# Altium schematic sheet Mini51BSch.SchDoc
size 284 x 210 mm; PageSetup: Record=PageOptions|CenterHorizontal=True|CenterVertical=True|PrintScale=0.98|XCorrection=1.00|YCorrection=1.00|PrintKind=0|BorderSize=5000000|LeftOffset=0|BottomOffset=0|Orientation=2|PaperLength=1000|PaperWidth=1000|Scale=100|PaperSource=7|PrintQuality=-4|MediaType=1|DitherType=10|PaperKind=A4|PrintScaleMode=1
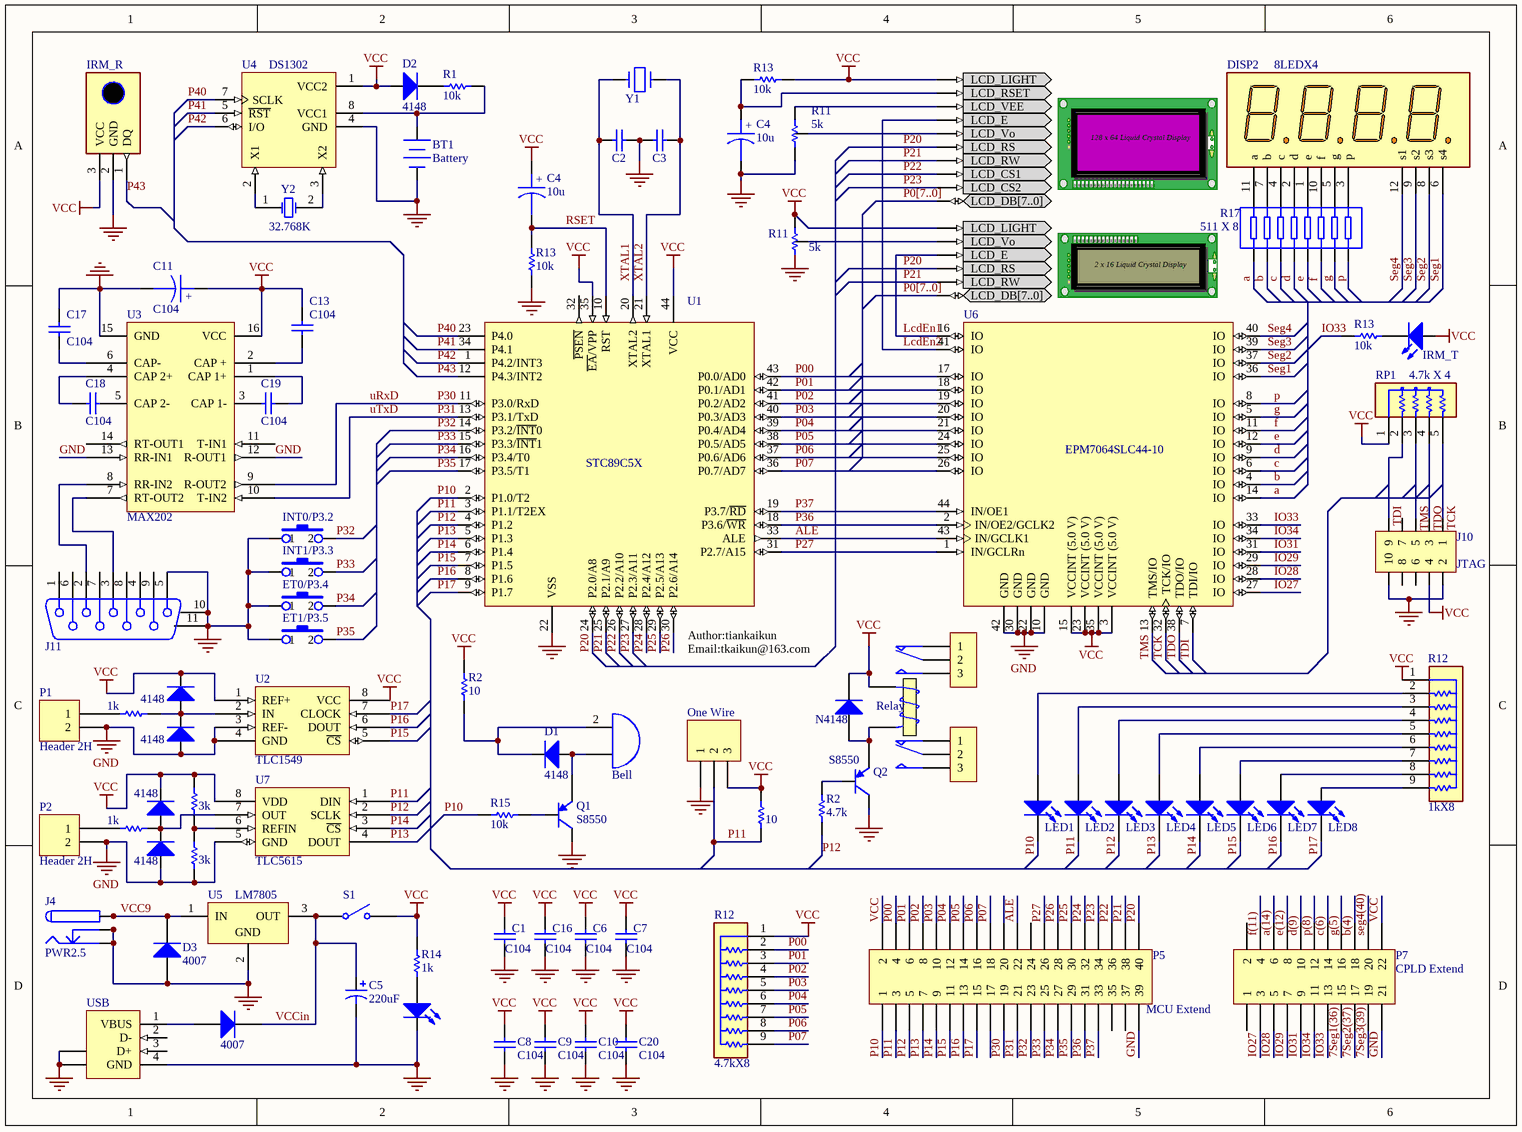
[diagram p0: Mini51BSch.SchDoc]

## Parts
(Parts that share a designator on the sheet are numbered #1, #2 ... from top to bottom, then left to right.)
?#1  LCD  (value not drawn)
?#2  LCD  (value not drawn)
BT1  Battery  [LI1220B]
C1  C104  [0805]
C2  C30  [0805]  (value not drawn)
C3  C30  [0805]  (value not drawn)
C4#1  10u  [CAP1.0C]
C4#2  10u  [CAP1.0C]
C5  220uF  [CAP1.0+]
C6  C104  [0805]
C7  C104  [0805]
C8  C104  [0805]
C9  C104  [0805]
C10  C104  [0805]
C11  C104  [0805]
C13  C104  [0805]
C16  C104  [0805]
C17  C104  [0805]
C18  C104  [0805]
C19  C104  [0805]
C20  C104  [0805]
D1#1  N4148  [DIO10.46-5.3x2.8]
D1#2  4148  [DIO7.1-3.9x1.9]
D2  4148  [DIO7.1-3.9x1.9]
D3#1  4007  [DIO7.1-3.9x1.9]
D3#2  4007  [DIO7.1-3.9x1.9]
D4  4148  [DIO7.1-3.9x1.9]
D5  4148  [DIO7.1-3.9x1.9]
D6  4148  [DIO7.1-3.9x1.9]
D7  4148  [DIO7.1-3.9x1.9]
DISP2  8LEDX4  [DISP3]
ET0/P3.4  SW-PB  [SW6X6]  (value not drawn)
ET1/P3.5  SW-PB  [SW6X6]  (value not drawn)
INT0/P3.2  SW-PB  [SW6X6]  (value not drawn)
INT1/P3.3  SW-PB  [SW6X6]  (value not drawn)
IRM_R  IRM  [HWJS]  (value not drawn)
IRM_T  P10  [LED0.3]  (value not drawn)
J4  PWR2.5  [KLD-0202]
J10  JTAG  [CON10]
J11  D Connector 9  [DSUB1.385-2H9]  (value not drawn)
J12#1  CON3 X 2  [CON3BIG]  (value not drawn)
J12#2  CON3 X 2  [CON3BIG]  (value not drawn)
K_X_2  Relay  [DIP-P5/X1.65]
LED1  P10  [LED0.3]  (value not drawn)
LED2  P10  [LED0.3]  (value not drawn)
LED3  P10  [LED0.3]  (value not drawn)
LED4  P10  [LED0.3]  (value not drawn)
LED5  P10  [LED0.3]  (value not drawn)
LED6  P10  [LED0.3]  (value not drawn)
LED7  P10  [LED0.3]  (value not drawn)
LED8  P10  [LED0.3]  (value not drawn)
LED9  P10  [LED0.3]  (value not drawn)
LS1  Bell  [BELL]
One_Wire  Header 3H  [HDR1X3H]  (value not drawn)
P1  Header 2H  [HDR1X2H]
P2  Header 2H  [HDR1X2H]
P5  MCU Extend  [HDR2X20]
P7  CPLD Extend  [HDR2X9]
Q1  S8550  [BCY-W3/E4]
Q2  S8550  [BCY-W3/E4]
R1  10k  [0805]
R2#1  10  [0805]
R2#2  4.7k  [AXIAL-0.5]
R2#3  10  [0805]
R3  1k  [CR2012-0805]
R11#1  5k  [VRX]
R11#2  5k  [VRX]
R12#1  1kX8  [SIP9A]
R12#2  4.7kX8  [SIP9A]
R13#1  10k  [CR2012-0805]
R13#2  10k  [CR2012-0805]
R13#3  10k  [CR2012-0805]
R13#4  1k  [CR2012-0805]
R13#5  3k  [CR2012-0805]
R13#6  3k  [CR2012-0805]
R14  1k  [CR2012-0805]
R15  10k  [0805]
R17  511 X 8  [SSO-G16/X.4]
RP1  4.7k X 4  [SIP5]
S1  SW-SPST  [SPST-2]  (value not drawn)
U1  STC89C5X
U2  TLC1549  [8S1]
U3  MAX202  [SO-16]
U4  DS1302  [DIP8]
U5  LM7805  [T03B]
U6  EPM7064SLC44-10  [PLCC44]
U7  TLC5615  [8S1]
USB  1-1470156-1  [1-1470156]  (value not drawn)
Y1  CRYSTAL  [CY]  (value not drawn)
Y2  32.768K  [BCY-W2/D3.1]

## Nets
GND: BT1.2(-) C1.2 C2.1 C3.1 C4#1.2 C5.2 C6.2 C7.2 C8.2 C9.2 C10.2 C11.2 C16.2 C17.1 C20.2 D3#1.1(A) D5.1(A) D7.1(A) ET0/P3.4.1 ET1/P3.5.1 INT0/P3.2.1 INT1/P3.3.1 IRM_R.2(GND) J4.2 J4.2A J4.2B J4.3 J4.3A J4.3B J10.2 J10.10 J11.5 J11.10(MH1) J11.11(MH2) LED9.2(K) One_Wire.1 P1.2 P2.2 P5.39 P7.21 Q1.3(C) Q2.3(C) R11#1.2(B) R13#2.2 R13#6.1 U1.22(VSS) U2.3(REF-) U2.4(GND) U3.12(R-OUT1) U3.13(RR-IN1) U3.15(GND) U4.4(GND) U5.2(GND) U6.10(GND) U6.22(GND) U6.30(GND) U6.42(GND) U7.5(GND) USB.4(GND) USB.5(SHLD) USB.6(SHLD) Y2.0
VCC: ?#1.LCD_LIGHT ?#2.LCD_LIGHT C1.1 C4#2.1 C6.1 C7.1 C8.1 C9.1 C10.1 C11.1 C13.1 C16.1 C20.1 D1#1.2(K) D2.1(A) D4.2(K) D6.2(K) IRM_R.3(VCC) IRM_T.1(A) J10.4 K_X_2.4(T1) One_Wire.3 P5.2 P7.22 R2#1.2 R2#3.2 R11#2.1(A) R12#1.1 R12#2.1 R13#1.2 R13#5.2 R14.2 RP1.1 S1.2(NO) U1.35(~{EA}/VPP) U1.44(VCC) U2.1(REF+) U2.8(VCC) U3.16(VCC) U4.1(VCC2) U6.3(VCCINT_(5.0_V)) U6.15(VCCINT_(5.0_V)) U6.23(VCCINT_(5.0_V)) U6.35(VCCINT_(5.0_V)) U7.8(VDD)
7Seg1(36): P7.15
7Seg2(37): P7.17
7Seg3(39): P7.19
a: R17.1 U6.14(IO)
ALE: P5.22 U1.33(ALE) U6.43(IN/GCLK1)
b: R17.2 U6.4(IO)
c: R17.3 U6.6(IO)
d: R17.4 U6.9(IO)
e: R17.5 U6.12(IO)
f: R17.6 U6.11(IO)
g: R17.7 U6.5(IO)
IO27: P7.3 U6.27(IO)
IO28: P7.5 U6.28(IO)
IO29: P7.7 U6.29(IO)
IO31: P7.9 U6.31(IO)
IO33: P7.13 R13#3.2 U6.33(IO)
IO34: P7.11 U6.34(IO)
LcdEn1: ?#2.LCD_E U6.16(IO)
LcdEn2: ?#1.LCD_E U6.41(IO)
p: R17.8 U6.8(IO)
P00: P5.4 R12#2.2 U1.43(P0.0/AD0) U6.17(IO)
P0[7..0]: ?#1.LCD_DB[7..0] ?#2.LCD_DB[7..0]
P01: P5.6 R12#2.3 U1.42(P0.1/AD1) U6.18(IO)
P02: P5.8 R12#2.4 U1.41(P0.2/AD2) U6.19(IO)
P03: P5.10 R12#2.5 U1.40(P0.3/AD3) U6.20(IO)
P04: P5.12 R12#2.6 U1.39(P0.4/AD4) U6.21(IO)
P05: P5.14 R12#2.7 U1.38(P0.5/AD5) U6.24(IO)
P06: P5.16 R12#2.8 U1.37(P0.6/AD6) U6.25(IO)
P07: P5.18 R12#2.9 U1.36(P0.7/AD7) U6.26(IO)
P10: LED1.2(K) P5.1 R15.1 U1.2(P1.0/T2)
P11: LED2.2(K) One_Wire.2 P5.3 R2#3.1 U1.3(P1.1/T2EX) U7.1(DIN)
P12: LED3.2(K) P5.5 R2#2.1 U1.4(P1.2) U7.2(SCLK)
P13: LED4.2(K) P5.7 U1.5(P1.3) U7.4(DOUT)
P14: LED5.2(K) P5.9 U1.6(P1.4) U7.3(~{CS})
P15: LED6.2(K) P5.11 U1.7(P1.5) U2.5(~{CS})
P16: LED7.2(K) P5.13 U1.8(P1.6) U2.6(DOUT)
P17: LED8.2(K) P5.15 U1.9(P1.7) U2.7(CLOCK)
P20: ?#1.LCD_RS ?#2.LCD_RS P5.40 U1.24(P2.0/A8)
P21: ?#1.LCD_RW ?#2.LCD_RW P5.38 U1.25(P2.1/A9)
P22: ?#1.LCD_CS1 P5.36 U1.26(P2.2/A10)
P23: ?#1.LCD_CS2 P5.34 U1.27(P2.3/A11)
P24: P5.32 U1.28(P2.4/A12)
P25: P5.30 U1.29(P2.5/A13)
P26: P5.28 U1.30(P2.6/A14)
P27: P5.26 U1.31(P2.7/A15) U6.1(IN/GCLRn)
P30: P5.19 U1.11(P3.0/RxD) U3.9(R-OUT2)  [also labelled uRxD]
P31: P5.21 U1.13(P3.1/TxD) U3.10(T-IN2)  [also labelled uTxD]
P32: INT0/P3.2.2 P5.23 U1.14(P3.2/~{INT}0)
P33: INT1/P3.3.2 P5.25 U1.15(P3.3/~{INT}1)
P34: ET0/P3.4.2 P5.27 U1.16(P3.4/T0)
P35: ET1/P3.5.2 P5.29 U1.17(P3.5/T1)
P36: P5.31 U1.18(P3.6/~{WR}) U6.2(IN/OE2/GCLK2)
P37: P5.33 U1.19(P3.7/~{RD}) U6.44(IN/OE1)
P40: U1.23(P4.0) U4.7(SCLK)
P41: U1.34(P4.1) U4.5(~{RST})
P42: U1.1(P4.2/INT3) U4.6(I/O)
P43: IRM_R.1(DQ) U1.12(P4.3/INT2)
RSET: C4#2.2 R13#2.1 U1.10(RST)
Seg1: DISP2.6(s4) U6.36(IO)
Seg2: DISP2.8(s3) U6.37(IO)
Seg3: DISP2.9(s2) U6.39(IO)
Seg4: DISP2.12(s1) U6.40(IO)
TCK: J10.1 RP1.5 U6.32(TCK/IO)
TDI: J10.9 RP1.2 U6.7(TDI/IO)
TDO: J10.3 RP1.4 U6.38(TDO/IO)
TMS: J10.5 RP1.3 U6.13(TMS/IO)
VCC9: D3#1.2(K) J4.1 J4.1A J4.1B U5.1(IN)
VCCin: C5.1 D3#2.2(K) S1.1(COMMON) U5.3(OUT)
XTAL1: C2.2 U1.20(XTAL2) Y1.1
XTAL2: C3.2 U1.21(XTAL1) Y1.2
Net?#1_LCD_LIGHT: ?#1.LCD_LIGHT(LCD_Vo) R11#1.3(TAP)
Net?#1_LCD_RSET: ?#1.LCD_RSET C4#1.1 R13#1.1
Net?#1_LCD_VEE: ?#1.LCD_VEE R11#1.1(A)
Net?#2_LCD_LIGHT: ?#2.LCD_LIGHT(LCD_Vo) R11#2.3(TAP)
NetBT1_1: BT1.1(+) R1.2 U4.8(VCC1)
NetC13_2: C13.2 U3.2(CAP_+)
NetC17_2: C17.2 U3.6(CAP-)
NetC18_1: C18.1 U3.4(CAP_2+)
NetC18_2: C18.2 U3.5(CAP_2-)
NetC19_1: C19.1 U3.3(CAP_1-)
NetC19_2: C19.2 U3.1(CAP_1+)
NetD1#1_1: D1#1.1(A) K_X_2.5(T2) Q2.1(E)
NetD1#2_1: D1#2.1(A) LS1.1(A) Q1.1(E)
NetD1#2_2: D1#2.2(K) LS1.2(B) R2#1.1
NetD2_2: D2.2(K) R1.1
NetD3#2_1: D3#2.1(A) USB.1(VBUS)
NetD4_1: D4.1(A) D5.2(K) R3.2 U2.2(IN)
NetD6_1: D6.1(A) D7.2(K) R13#4.2 U7.7(OUT)
NetDISP2_1: DISP2.1(e) R17.12
NetDISP2_2: DISP2.2(d) R17.13
NetDISP2_3: DISP2.3(p) R17.9
NetDISP2_4: DISP2.4(c) R17.14
NetDISP2_5: DISP2.5(g) R17.10
NetDISP2_7: DISP2.7(b) R17.15
NetDISP2_10: DISP2.10(f) R17.11
NetDISP2_11: DISP2.11(a) R17.16
NetIRM_T_2: IRM_T.2(K) R13#3.1
NetJ11_2: J11.2 U3.8(RR-IN2)
NetJ11_3: J11.3 U3.7(RT-OUT2)
NetLED1_1: LED1.1(A) R12#1.2
NetLED2_1: LED2.1(A) R12#1.3
NetLED3_1: LED3.1(A) R12#1.4
NetLED4_1: LED4.1(A) R12#1.5
NetLED5_1: LED5.1(A) R12#1.6
NetLED6_1: LED6.1(A) R12#1.7
NetLED7_1: LED7.1(A) R12#1.8
NetLED8_1: LED8.1(A) R12#1.9
NetLED9_1: LED9.1(A) R14.1
NetP1_1: P1.1 R3.1
NetP2_1: P2.1 R13#4.1
NetQ1_2: Q1.2(B) R15.2
NetQ2_2: Q2.2(B) R2#2.2
NetR13#5_1: R13#5.1 R13#6.2 U7.6(REFIN)
NetU4_2: U4.2(X1) Y2.1(OSC1)
NetU4_3: U4.3(X2) Y2.2(OSC2)

Not connected (* = marked no-connect by the designer): J10 6 7 8; J11 1 4 6 7 8 9; J12#1 1 2 3; J12#2 1 2 3; P5 17 20 24 35 37; P7 1 2 4 6 8 10 12 14 16 18 20; R11#2 2(B); U1 32(~{PSEN}); U3 11(T-IN1) 14(RT-OUT1); USB 2(D-) 3(D+)

## Buses and harness runs
bus P0[7..0]

## Notes on the sheet
- (near U1) Author:tiankaikun
  Email:tkaikun@163.com
- Labels drawn without touching a wire or pin: a(14), b(4), c(6), d(9), e(12), f(11), g(5), GND, p(8), seg4(40)
- (in symbol CAPACITOR POL) +
- (in symbol LCD) 2 x 16 Liquid Crystal Display
- (in symbol LCD_12864) 128 x 64 Liquid Crystal Display

## Library data of the parts
?#1 = LCD_12864: Liquid Crystal Display; PortComponent: True; Published: 19-Nov-2003; Publisher: Altium Limited; HelpURL: TR0102 NanoBoard Technical Reference Manual - NB1.pdf#page=39
?#2 = LCD: Liquid Crystal Display; PortComponent: True; Published: 19-Nov-2003; Publisher: Altium Limited; HelpURL: TR0102 NanoBoard Technical Reference Manual - NB1.pdf#page=39
BT1 = Battery: Multicell Battery; Published: 24-Mar-1999; LatestRevisionDate: 17-Jul-2002; LatestRevisionNote: Re-released for DXP Platform.; Publisher: Altium Limited
C1-C3 C6-C10 C13 C16-C20 = Cap: Capacitor; Published: 8-Jun-2000; LatestRevisionDate: 17-Jul-2002; LatestRevisionNote: Re-released for DXP Platform.; Publisher: Altium Limited
C4#1 C4#2 C11 = CAPACITOR POL: Capacitor
C5 = Cap Pol1: Polarized Capacitor (Radial); Published: 8-Jun-2000; LatestRevisionDate: 17-Jul-2002; LatestRevisionNote: Re-released for DXP Platform.; Publisher: Altium Limited
D1#1 = Diode 1N4007: 1 Amp General Purpose Rectifier; Published: 8-Jun-2000; LatestRevisionDate: 17-Jul-2002; LatestRevisionNote: Re-released for DXP Platform.; DatasheetDocument: 1998; PackageDocument: Aug-1999; PackageReference: DO-41; Publisher: Altium Limited; ComponentLink1Description: Manufacturer Link; ComponentLink1URL: http://www.fairchildsemi.com/; Code_JEDEC: DO-204-AL
D1#2 D2 D3#1 D3#2 D4-D7 = Diode 1N914: High Conductance Fast Diode; Published: 8-Jun-2000; LatestRevisionDate: 17-Jul-2002; LatestRevisionNote: Re-released for DXP Platform.; DatasheetDocument: 1997; PackageReference: DO-35; Publisher: Altium Limited; ComponentLink1Description: Manufacturer Link; ComponentLink1URL: http://www.fairchildsemi.com/; Code_JEDEC: DO-204-AH
DISP2 = DISPLED4: 7SegLedX4
IRM_R = IRM: Header, 3-Pin, Right Angle; LatestRevisionDate: 17-Jul-2002; LatestRevisionNote: Re-released for DXP Platform.; Publisher: Altium Limited
IRM_T LED1-LED9 = LED0: Typical INFRARED GaAs LED; Published: 8-Jun-2000; LatestRevisionDate: 17-Jul-2002; LatestRevisionNote: Re-released for DXP Platform.; Publisher: Altium Limited
J4 = PWR2.5: Low Voltage Power Supply Connector; Published: 17-Dec-2003; DatasheetDocument: 09-May-2002; Publisher: Altium Limited; ComponentLink1Description: Manufacturer Link; ComponentLink1URL: http://domino.kycon.com/internet/Products.html
J10 = Header 5X2: Header, 5-Pin, Dual row; LatestRevisionDate: 17-Jul-2002; LatestRevisionNote: Re-released for DXP Platform.; Publisher: Altium Limited
J11 = D Connector 9: Receptacle Assembly, 9 Position, Right Angle; PackageDocument: O; Positions: 9; Published: 15-Jun-2001; LatestRevisionDate: 17-Jul-2002; LatestRevisionNote: Re-released for DXP Platform.; DatasheetDocument: 1-Sep-1999; PackageReference: 788750; Publisher: Altium Limited; Orientation: Right Angle; Gender: Receptacle
J12#1 J12#2 = CON3: Connector
K_X_2 = Relay: SPDT Relay; Published: 8-Jun-2000; LatestRevisionDate: 17-Jul-2002; LatestRevisionNote: Re-released for DXP Platform.; Publisher: Altium Limited
LS1 = Bell: Electrical Bell; Published: 24-Mar-1999; LatestRevisionDate: 17-Jul-2002; LatestRevisionNote: Re-released for DXP Platform.; Publisher: Altium Limited
One_Wire = Header 3H: Header, 3-Pin, Right Angle; LatestRevisionDate: 17-Jul-2002; LatestRevisionNote: Re-released for DXP Platform.; Publisher: Altium Limited
P1 P2 = Header 2H: Header, 2-Pin, Right Angle; LatestRevisionDate: 17-Jul-2002; LatestRevisionNote: Re-released for DXP Platform.; Publisher: Altium Limited
P5 = Header 20X2: Header, 20-Pin, Dual row; LatestRevisionDate: 17-Jul-2002; LatestRevisionNote: Re-released for DXP Platform.; Publisher: Altium Limited
P7 = Header 9X2: Header, 9-Pin, Dual row; LatestRevisionDate: 17-Jul-2002; LatestRevisionNote: Re-released for DXP Platform.; Publisher: Altium Limited
Q1 Q2 = 2N3906: PNP General Purpose Amplifier; Published: 8-Jun-2000; LatestRevisionDate: 15-Jan-2003; LatestRevisionNote: PCB Footprint 'BCY-W3/D4.7' replaced; DatasheetDocument: 1997; PackageDocument: Sep-1998; PackageReference: TO-92A; Publisher: Altium Limited; Code_JEDEC: TO-92A
R1 R2#1-R2#3 R3 R13#1-R13#6 R14 R15 = Res Semi: Semiconductor Resistor; Published: 8-Jun-2000; LatestRevisionDate: 17-Jul-2002; LatestRevisionNote: Re-released for DXP Platform.; Publisher: Altium Limited
R11#1 R11#2 = Res Tap: Tapped Resistor; Sim Note: Enter the Resistance value and the set point into parameter fields.; Published: 24-Mar-1999; LatestRevisionDate: 17-Jul-2002; LatestRevisionNote: Re-released for DXP Platform.; Publisher: Altium Limited
R12#1 R12#2 = Res Pack8: Isolated Resistor Network; Published: 24-Mar-1999; LatestRevisionDate: 17-Jul-2002; LatestRevisionNote: Re-released for DXP Platform.; Publisher: Altium Limited; Code_JEDEC: MO-150-AC
R17 = Res Pack4_1: Isolated Resistor Network; Published: 24-Mar-1999; LatestRevisionDate: 17-Jul-2002; LatestRevisionNote: Re-released for DXP Platform.; Publisher: Altium Limited; Code_JEDEC: MO-150-AC
RP1 = RES PACK4: Isolated Resistor Network; Published: 24-Mar-1999; LatestRevisionDate: 17-Jul-2002; LatestRevisionNote: Re-released for DXP Platform.; Publisher: Altium Limited; Code_JEDEC: MO-150-AC
S1 = SW-SPST: Single-Pole, Single-Throw Switch; Published: 24-Mar-1999; LatestRevisionDate: 17-Jul-2002; LatestRevisionNote: Re-released for DXP Platform.; PackageReference: SPST-2; Publisher: Altium Limited
U1 = STC89C5X: 80C51 8-Bit Flash Microcontroller Family, 8 kB Flash; Published: 21-May-2003; DatasheetDocument: 5-Jun-2002; PackageDocument: 24-Jan-2002; PackageReference: SOT389-1; Publisher: Altium Limited; ComponentLink1Description: Manufacturer Link; ComponentLink1URL: http://www-us2.semiconductors.philips.com/; Code_JEDEC: MO-026
U3 = MAX232
U4 = DS1302: Trickle Charge Timekeeping Chip; PackageDocument: 1999; Published: 13-Oct-2000; LatestRevisionDate: 4-Mar-2005; LatestRevisionNote: Stylized 3D Model Added.; DatasheetDocument: 2-Jul-1999; PackageReference: DIP8; Publisher: Altium Limited; ComponentLink1Description: Manufacturer Link; ComponentLink1URL: http://www.maxim-ic.com/
U5 = LM7805CT: Series 3-Terminal Positive Regulator; PackageDocument: 1995; Note: Tab is connected to GND; Published: 15-Apr-2002; DatasheetDocument: May-1999; PackageReference: T03B; Publisher: Altium Limited; ComponentLink1Description: Manufacturer Link; ComponentLink1URL: http://www.national.com/
U6 = EPM7064SLC44-10_1: MAX 7000S 5V In-System Programmable CPLD, 64 Macrocells, 44-Pin PLCC, Speed Grade 10, Commercial Grade; PackageDocument: ver12.0, Oct-2003; Published: 24-Nov-2000; LatestRevisionDate: 17-Jul-2002; LatestRevisionNote: Re-released for DXP Platform.; DatasheetDocument: ver6.6, Jun-2003; PackageReference: PLCC44; Publisher: Altium Limited; ComponentLink1Description: MAX 7000 Overview; ComponentLink1URL: http://www.altera.com/products/devices/max7k/m7k-index.html; ComponentLink2Description: Datasheet; ComponentLink2URL: http://www.altera.com/literature/ds/m7000.pdf; ComponentLink3Description: Pinout Specification; ComponentLink3URL: http://www.altera.com/literature/dp/max7k/epm7064.pdf; ComponentLink4Description: Packaging Specification; ComponentLink4URL: http://www.altera.com/literature/ds/dspkg.pdf; Code_IPC: PLCC-44
USB = 1-1470156-1: USB 1.1, Right Angle, Thru-Hole, B Type, Receptacle, 4 Position, White; ContactMaterial: Phosphor Bronze; ContactPlating: Gold over Nickel; TerminationLength: 3.00mm [0.118in.]; PCB_Layout: Complies with manufacturer's recommendation.; DrillSize: Corresponds to nominal value.; PanelGround: Without; Published: 15-Jul-2004; DatasheetDocument: 02-Jun-2001; PackageDocument: 02-Jun-2001; PackageReference: 1-1470156; Publisher: Altium Limited; ComponentLink1Description: Manufacturer Link; ComponentLink1URL: http://www.tycoelectronics.com/; HousingMaterial: Glass-Filled Thermoplastic
Y2 = XTAL: Crystal Oscillator; Published: 8-Jun-2000; LatestRevisionDate: 17-Jul-2002; LatestRevisionNote: Re-released for DXP Platform.; PackageReference: R38; Publisher: Altium Limited